# Altium project rX-rP.X4.PrjPcb
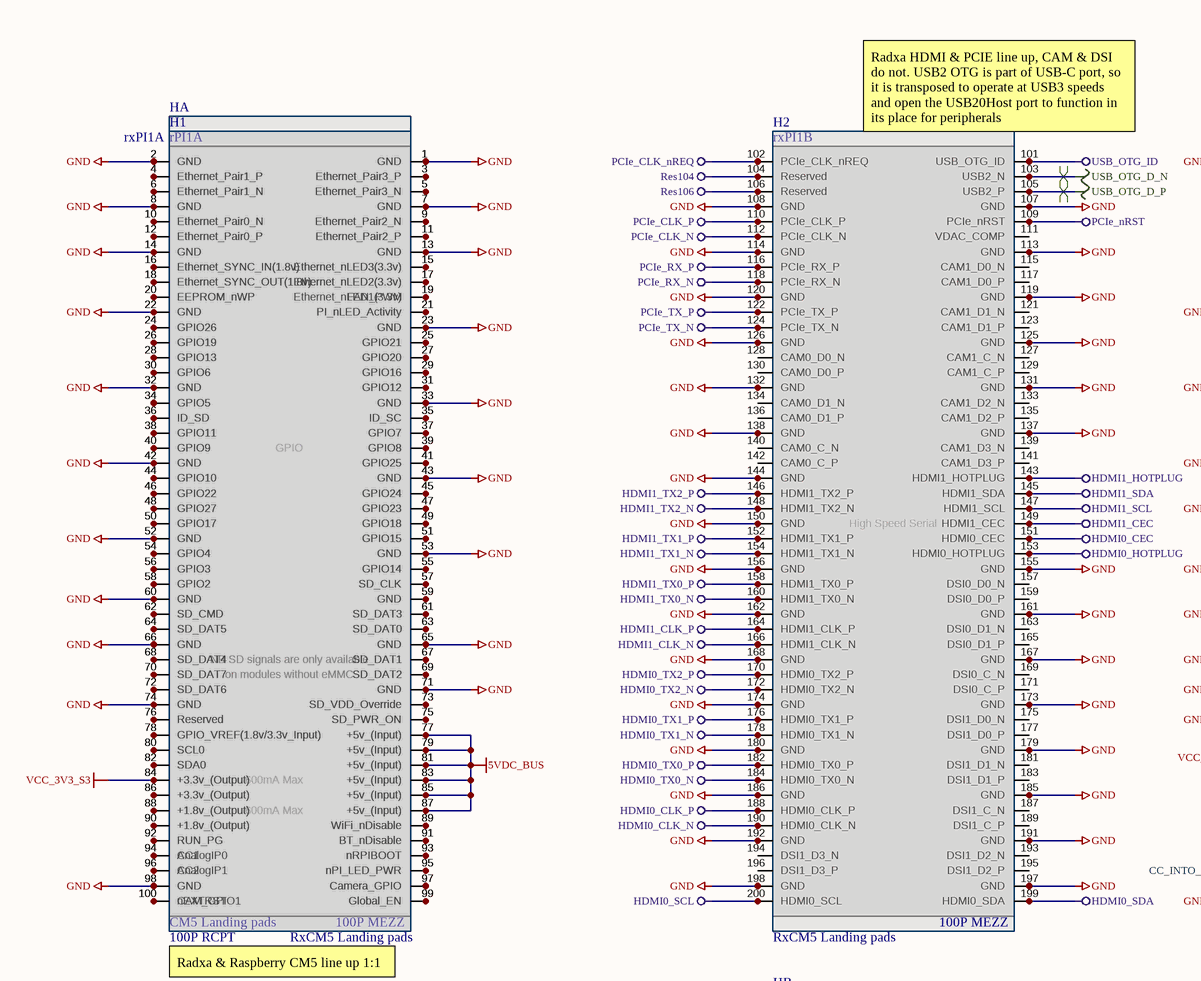
[diagram p0: CM5 Adapter.SchDoc, top left]
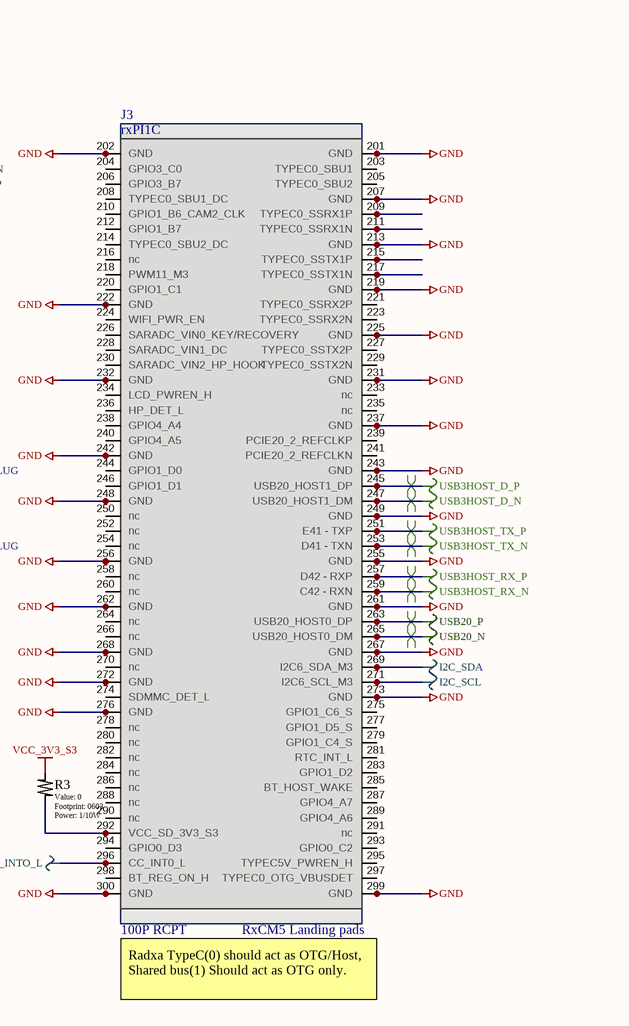
[diagram p1: CM5 Adapter.SchDoc, top right]
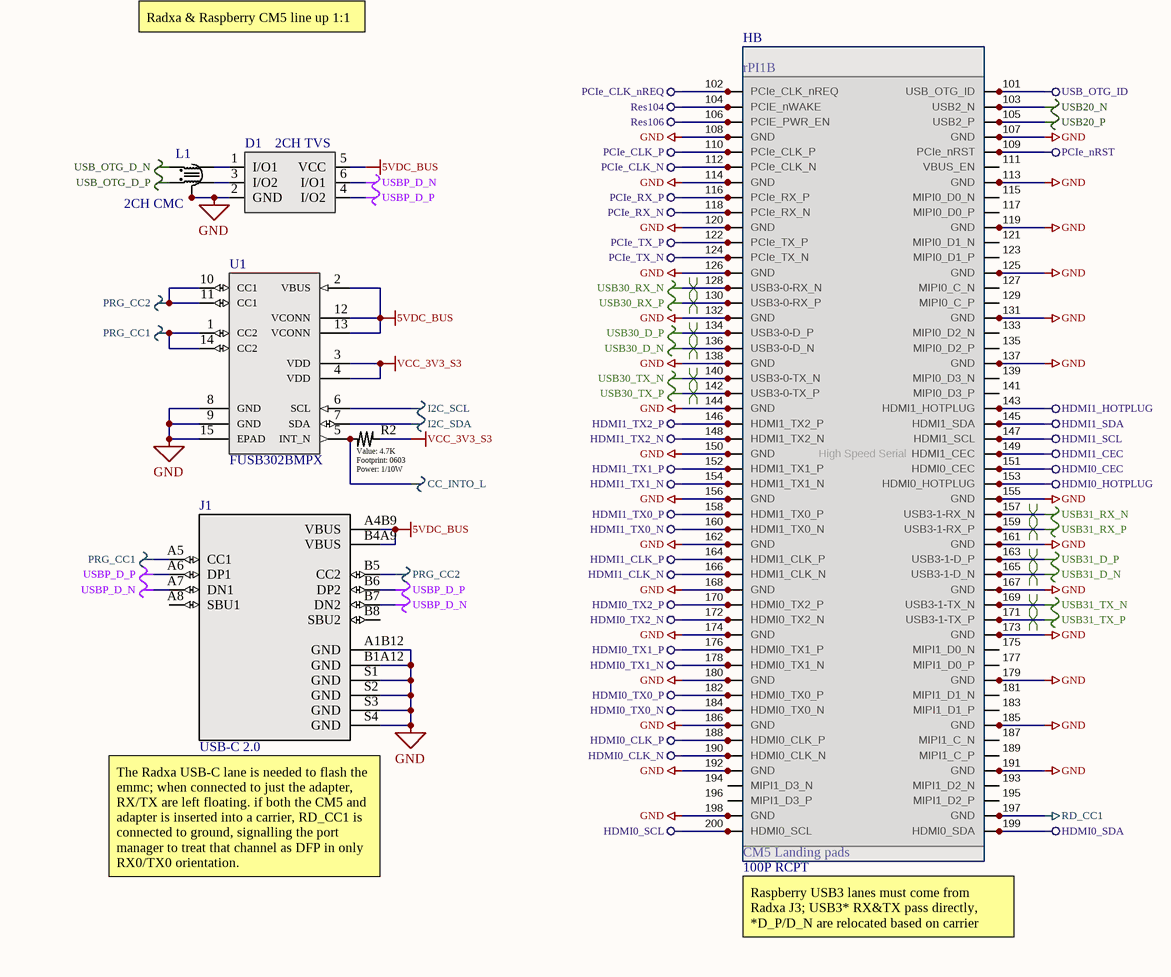
[diagram p2: CM5 Adapter.SchDoc, bottom left]
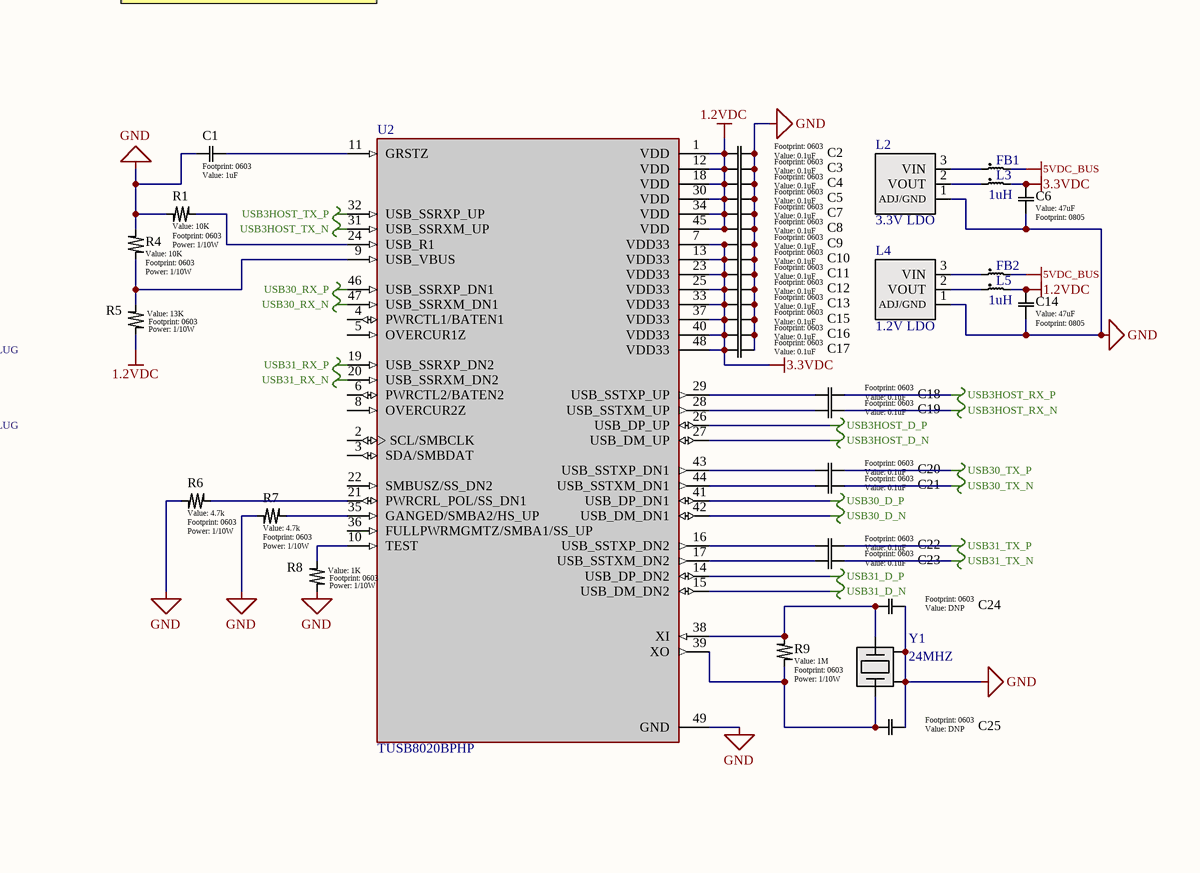
[diagram p3: CM5 Adapter.SchDoc, bottom right]
1 sheet, 53 parts. Net scope: global (net labels, ports and power ports of the same name join across sheets).
Board file: CM5_Adapter.PcbDoc

## Sheet CM5 Adapter.SchDoc
size C; SheetNumber: 1; SheetTotal: 1

### Parts
C1  value 1uF  [0603]  (hidden comment: Generic Capacitor)
C2  value 0.1uF  [0603]  (hidden comment: Generic Capacitor)
C3  value 0.1uF  [0603]  (hidden comment: Generic Capacitor)
C4  value 0.1uF  [0603]  (hidden comment: Generic Capacitor)
C5  value 0.1uF  [0603]  (hidden comment: Generic Capacitor)
C6  value 47uF  [0805]  (hidden comment: Generic Capacitor)
C7  value 0.1uF  [0603]  (hidden comment: Generic Capacitor)
C8  value 0.1uF  [0603]  (hidden comment: Generic Capacitor)
C9  value 0.1uF  [0603]  (hidden comment: Generic Capacitor)
C10  value 0.1uF  [0603]  (hidden comment: Generic Capacitor)
C11  value 0.1uF  [0603]  (hidden comment: Generic Capacitor)
C12  value 0.1uF  [0603]  (hidden comment: Generic Capacitor)
C13  value 0.1uF  [0603]  (hidden comment: Generic Capacitor)
C14  value 47uF  [0805]  (hidden comment: Generic Capacitor)
C15  value 0.1uF  [0603]  (hidden comment: Generic Capacitor)
C16  value 0.1uF  [0603]  (hidden comment: Generic Capacitor)
C17  value 0.1uF  [0603]  (hidden comment: Generic Capacitor)
C18  value 0.1uF  [0603]  (hidden comment: Generic Capacitor)
C19  value 0.1uF  [0603]  (hidden comment: Generic Capacitor)
C20  value 0.1uF  [0603]  (hidden comment: Generic Capacitor)
C21  value 0.1uF  [0603]  (hidden comment: Generic Capacitor)
C22  value 0.1uF  [0603]  (hidden comment: Generic Capacitor)
C23  value 0.1uF  [0603]  (hidden comment: Generic Capacitor)
C24  value DNP  [0603]  (hidden comment: Generic Capacitor)
C25  value DNP  [0603]  (hidden comment: Generic Capacitor)
D1  2CH TVS  [FP-SOT886-MFG]
FB1  BLM21PG221SN1D  [0805]  (value not drawn)
FB2  BLM21PG221SN1D  [0805]  (value not drawn)
H1  100P RCPT  [DF40C-100DS-0.4V(51)]
H2  100P MEZZ  [DF40C-100DS-0.4V(51)]
HA  100P MEZZ  [DF40C-100DP-0.4V(51)]
HB  100P RCPT  [DF40C-100DP-0.4V(51)]
J1  USB-C 2.0  [GT-USB-7010ASV]
J3  100P RCPT  [DF40C-100DS-0.4V(51)]
L1  2CH CMC  [SMD-6-2CH]
L2  3.3V LDO  [SOT-223-3]
L3  1uH  [0806]
L4  1.2V LDO  [SOT-223-3]
L5  1uH  [0806]
R1  value 10K  Power: 1/10W  [0603]  (hidden comment: Generic Resistor)
R2  value 4.7K  Power: 1/10W  [0603]  (hidden comment: Generic Resistor)
R3  value 0  Power: 1/10W  [0603]  (hidden comment: Generic Resistor)
R4  value 10K  Power: 1/10W  [0603]  (hidden comment: Generic Resistor)
R5  value 13K  Power: 1/10W  [0603]  (hidden comment: Generic Resistor)
R6  value 4.7k  Power: 1/10W  [0603]  (hidden comment: Generic Resistor)
R7  value 4.7k  Power: 1/10W  [0603]  (hidden comment: Generic Resistor)
R8  value 1K  Power: 1/10W  [0603]  (hidden comment: Generic Resistor)
R9  value 1M  Power: 1/10W  [0603]  (hidden comment: Generic Resistor)
rPI1  CM5 Landing pads  [rP-200P-CM-REP (top)]  (parts A,B of 2)
rxPI1  RxCM5 Landing pads  [RX-300P-CM-FTPD]  (parts A,B,C of 3)
U1  FUSB302BMPX  [MLP14_2P5X2P5_ONS-L]
U2  TUSB8020BPHP  [HTQFP-48(7x7)]
Y1  24MHZ  [SMD2520-4P]

### Nets
1.2VDC: C2.2 C3.2 C4.2 C5.2 C7.2 C8.2 C14.1 L5.2 R5.1 U2.1(VDD) U2.12(VDD) U2.18(VDD) U2.30(VDD) U2.34(VDD) U2.45(VDD)
3.3VDC: C6.1 C9.2 C10.2 C11.2 C12.2 C13.2 C15.2 C16.2 C17.2 L3.2 U2.7(VDD33) U2.13(VDD33) U2.23(VDD33) U2.25(VDD33) U2.33(VDD33) U2.37(VDD33) U2.40(VDD33) U2.48(VDD33)
5VDC_BUS: D1.5(VCC) FB1.2 FB2.2 H1.77 H1.79 H1.81 H1.83 H1.85 H1.87 HA.78 HA.80 HA.82 HA.84 HA.86 HA.88 J1.A4B9(VBUS) J1.B4A9(VBUS) rPI1.77(+5v_(Input)) rPI1.79(+5v_(Input)) rPI1.81(+5v_(Input)) rPI1.83(+5v_(Input)) rPI1.85(+5v_(Input)) rPI1.87(+5v_(Input)) rxPI1.77(+5v_(Input)) rxPI1.79(+5v_(Input)) rxPI1.81(+5v_(Input)) rxPI1.83(+5v_(Input)) rxPI1.85(+5v_(Input)) rxPI1.87(+5v_(Input)) U1.2(VBUS) U1.12(VCONN) U1.13(VCONN)
CC_INTO_L: J3.95 R2.1 rxPI1.296(CC_INT0_L) U1.5(INT_N)
GND: C1.1 C2.1 C3.1 C4.1 C5.1 C6.2 C7.1 C8.1 C9.1 C10.1 C11.1 C12.1 C13.1 C14.2 C15.1 C16.1 C17.1 C24.1 C25.1 D1.2(GND) H1.1 H1.2 H1.7 H1.8 H1.13 H1.14 H1.22 H1.23 H1.32 H1.33 H1.42 H1.43 H1.52 H1.53 H1.60 H1.65 H1.66 H1.71 H1.74 H1.98 H2.7 H2.8 H2.13 H2.14 H2.19 H2.20 H2.25 H2.26 H2.31 H2.32 H2.37 H2.38 H2.44 H2.50 H2.55 H2.56 H2.61 H2.62 H2.67 H2.68 H2.73 H2.74 H2.79 H2.80 H2.85 H2.86 H2.91 H2.92 H2.97 H2.98 HA.1 HA.2 HA.7 HA.8 HA.13 HA.14 HA.21 HA.24 HA.31 HA.34 HA.41 HA.44 HA.51 HA.54 HA.59 HA.65 HA.66 HA.72 HA.73 HA.97 HB.7 HB.8 HB.13 HB.14 HB.19 HB.20 HB.25 HB.26 HB.31 HB.32 HB.37 HB.38 HB.43 HB.49 HB.55 HB.56 HB.61 HB.62 HB.67 HB.68 HB.73 HB.74 HB.79 HB.80 HB.85 HB.86 HB.91 HB.92 HB.97 J1.A1B12(GND) J1.B1A12(GND) J1.S1(GND) J1.S2(GND) J1.S3(GND) J1.S4(GND) J3.1 J3.2 J3.8 J3.14 J3.20 J3.21 J3.26 J3.31 J3.32 J3.38 J3.41 J3.44 J3.47 J3.50 J3.55 J3.56 J3.61 J3.62 J3.67 J3.68 J3.71 J3.74 J3.75 J3.99 J3.100 L1.5 L1.6 L2.1(ADJ/GND) L4.1(ADJ/GND) R1.1 R4.1 R6.1 R7.1 R8.1 rPI1.1(GND) rPI1.2(GND) rPI1.7(GND) rPI1.8(GND) rPI1.13(GND) rPI1.14(GND) rPI1.22(GND) rPI1.23(GND) rPI1.32(GND) rPI1.33(GND) rPI1.42(GND) rPI1.43(GND) rPI1.52(GND) rPI1.53(GND) rPI1.60(GND) rPI1.65(GND) rPI1.66(GND) rPI1.71(GND) rPI1.74(GND) rPI1.98(GND) rPI1.107(GND) rPI1.108(GND) rPI1.113(GND) rPI1.114(GND) rPI1.119(GND) rPI1.120(GND) rPI1.125(GND) rPI1.126(GND) rPI1.131(GND) rPI1.132(GND) rPI1.137(GND) rPI1.138(GND) rPI1.144(GND) rPI1.150(GND) rPI1.155(GND) rPI1.156(GND) rPI1.161(GND) rPI1.162(GND) rPI1.167(GND) rPI1.168(GND) rPI1.173(GND) rPI1.174(GND) rPI1.179(GND) rPI1.180(GND) rPI1.185(GND) rPI1.186(GND) rPI1.191(GND) rPI1.192(GND) rPI1.198(GND) rxPI1.1(GND) rxPI1.2(GND) rxPI1.7(GND) rxPI1.8(GND) rxPI1.13(GND) rxPI1.14(GND) rxPI1.22(GND) rxPI1.23(GND) rxPI1.32(GND) rxPI1.33(GND) rxPI1.42(GND) rxPI1.43(GND) rxPI1.52(GND) rxPI1.53(GND) rxPI1.60(GND) rxPI1.65(GND) rxPI1.66(GND) rxPI1.71(GND) rxPI1.74(GND) rxPI1.98(GND) rxPI1.107(GND) rxPI1.108(GND) rxPI1.113(GND) rxPI1.114(GND) rxPI1.119(GND) rxPI1.120(GND) rxPI1.125(GND) rxPI1.126(GND) rxPI1.131(GND) rxPI1.132(GND) rxPI1.137(GND) rxPI1.138(GND) rxPI1.144(GND) rxPI1.150(GND) rxPI1.155(GND) rxPI1.156(GND) rxPI1.161(GND) rxPI1.162(GND) rxPI1.167(GND) rxPI1.168(GND) rxPI1.173(GND) rxPI1.174(GND) rxPI1.179(GND) rxPI1.180(GND) rxPI1.185(GND) rxPI1.186(GND) rxPI1.191(GND) rxPI1.192(GND) rxPI1.197(GND) rxPI1.198(GND) rxPI1.201(GND) rxPI1.202(GND) rxPI1.207(GND) rxPI1.213(GND) rxPI1.219(GND) rxPI1.222(GND) rxPI1.225(GND) rxPI1.231(GND) rxPI1.232(GND) rxPI1.237(GND) rxPI1.242(GND) rxPI1.243(GND) rxPI1.248(GND) rxPI1.249(GND) rxPI1.255(GND) rxPI1.256(GND) rxPI1.261(GND) rxPI1.262(GND) rxPI1.267(GND) rxPI1.268(GND) rxPI1.272(GND) rxPI1.273(GND) rxPI1.276(GND) rxPI1.299(GND) rxPI1.300(GND) U1.8(GND) U1.9(GND) U1.15(EPAD) U2.49(GND) Y1.2(GND) Y1.4(GND)
HDMI0_CEC: H2.51 HB.52 rPI1.151(HDMI0_CEC) rxPI1.151(HDMI0_CEC)
HDMI0_CLK_N: H2.90 HB.89 rPI1.190(HDMI0_CLK_N) rxPI1.190(HDMI0_CLK_N)
HDMI0_CLK_P: H2.88 HB.87 rPI1.188(HDMI0_CLK_P) rxPI1.188(HDMI0_CLK_P)
HDMI0_HOTPLUG: H2.53 HB.54 rPI1.153(HDMI0_HOTPLUG) rxPI1.153(HDMI0_HOTPLUG)
HDMI0_SCL: H2.100 HB.99 rPI1.200(HDMI0_SCL) rxPI1.200(HDMI0_SCL)
HDMI0_SDA: H2.99 HB.100 rPI1.199(HDMI0_SDA) rxPI1.199(HDMI0_SDA)
HDMI0_TX0_N: H2.84 HB.83 rPI1.184(HDMI0_TX0_N) rxPI1.184(HDMI0_TX0_N)
HDMI0_TX0_P: H2.82 HB.81 rPI1.182(HDMI0_TX0_P) rxPI1.182(HDMI0_TX0_P)
HDMI0_TX1_N: H2.78 HB.77 rPI1.178(HDMI0_TX1_N) rxPI1.178(HDMI0_TX1_N)
HDMI0_TX1_P: H2.76 HB.75 rPI1.176(HDMI0_TX1_P) rxPI1.176(HDMI0_TX1_P)
HDMI0_TX2_N: H2.72 HB.71 rPI1.172(HDMI0_TX2_N) rxPI1.172(HDMI0_TX2_N)
HDMI0_TX2_P: H2.70 HB.69 rPI1.170(HDMI0_TX2_P) rxPI1.170(HDMI0_TX2_P)
HDMI1_CEC: H2.49 HB.50 rPI1.149(HDMI1_CEC) rxPI1.149(HDMI1_CEC)
HDMI1_CLK_N: H2.66 HB.65 rPI1.166(HDMI1_CLK_N) rxPI1.166(HDMI1_CLK_N)
HDMI1_CLK_P: H2.64 HB.63 rPI1.164(HDMI1_CLK_P) rxPI1.164(HDMI1_CLK_P)
HDMI1_HOTPLUG: H2.43 HB.44 rPI1.143(HDMI1_HOTPLUG) rxPI1.143(HDMI1_HOTPLUG)
HDMI1_SCL: H2.47 HB.48 rPI1.147(HDMI1_SCL) rxPI1.147(HDMI1_SCL)
HDMI1_SDA: H2.45 HB.46 rPI1.145(HDMI1_SDA) rxPI1.145(HDMI1_SDA)
HDMI1_TX0_N: H2.60 HB.59 rPI1.160(HDMI1_TX0_N) rxPI1.160(HDMI1_TX0_N)
HDMI1_TX0_P: H2.58 HB.57 rPI1.158(HDMI1_TX0_P) rxPI1.158(HDMI1_TX0_P)
HDMI1_TX1_N: H2.54 HB.53 rPI1.154(HDMI1_TX1_N) rxPI1.154(HDMI1_TX1_N)
HDMI1_TX1_P: H2.52 HB.51 rPI1.152(HDMI1_TX1_P) rxPI1.152(HDMI1_TX1_P)
HDMI1_TX2_N: H2.48 HB.47 rPI1.148(HDMI1_TX2_N) rxPI1.148(HDMI1_TX2_N)
HDMI1_TX2_P: H2.46 HB.45 rPI1.146(HDMI1_TX2_P) rxPI1.146(HDMI1_TX2_P)
I2C_SCL: J3.72 rxPI1.271(I2C6_SCL_M3) U1.6(SCL)
I2C_SDA: J3.70 rxPI1.269(I2C6_SDA_M3) U1.7(SDA)
PCIe_CLK_N: H2.12 HB.11 rPI1.112(PCIe_CLK_N) rxPI1.112(PCIe_CLK_N)
PCIe_CLK_nREQ: H2.2 HB.1 rPI1.102(PCIe_CLK_nREQ) rxPI1.102(PCIe_CLK_nREQ)
PCIe_CLK_P: H2.10 HB.9 rPI1.110(PCIe_CLK_P) rxPI1.110(PCIe_CLK_P)
PCIe_nRST: H2.9 HB.10 rPI1.109(PCIe_nRST) rxPI1.109(PCIe_nRST)
PCIe_RX_N: H2.18 HB.17 rPI1.118(PCIe_RX_N) rxPI1.118(PCIe_RX_N)
PCIe_RX_P: H2.16 HB.15 rPI1.116(PCIe_RX_P) rxPI1.116(PCIe_RX_P)
PCIe_TX_N: H2.24 HB.23 rPI1.124(PCIe_TX_N) rxPI1.124(PCIe_TX_N)
PCIe_TX_P: H2.22 HB.21 rPI1.122(PCIe_TX_P) rxPI1.122(PCIe_TX_P)
PRG_CC1: J1.A5(CC1) U1.1(CC2) U1.14(CC2)
PRG_CC2: J1.B5(CC2) U1.10(CC1) U1.11(CC1)
RD_CC1: HB.98 rPI1.197(GND)
Res104: H2.4 HB.3 rPI1.104(PCIE_nWAKE) rxPI1.104(Reserved)
Res106: H2.6 HB.5 rPI1.106(PCIE_PWR_EN) rxPI1.106(Reserved)
USB3HOST_D_N: J3.48 rxPI1.247(USB20_HOST1_DM) U2.27(USB_DM_UP)
USB3HOST_D_P: J3.46 rxPI1.245(USB20_HOST1_DP) U2.26(USB_DP_UP)
USB3HOST_RX_N: C19.1 J3.60 rxPI1.259(C42_-_RXN)
USB3HOST_RX_P: C18.1 J3.58 rxPI1.257(D42_-_RXP)
USB3HOST_TX_N: J3.54 rxPI1.253(D41_-_TXN) U2.31(USB_SSRXM_UP)
USB3HOST_TX_P: J3.52 rxPI1.251(E41_-_TXP) U2.32(USB_SSRXP_UP)
USB20_N: HB.4 J3.66 rPI1.103(USB2_N) rxPI1.265(USB20_HOST0_DM)
USB20_P: HB.6 J3.64 rPI1.105(USB2_P) rxPI1.263(USB20_HOST0_DP)
USB30_D_N: HB.35 rPI1.136(USB3-0-D_N) U2.42(USB_DM_DN1)
USB30_D_P: HB.33 rPI1.134(USB3-0-D_P) U2.41(USB_DP_DN1)
USB30_RX_N: HB.27 rPI1.128(USB3-0-RX_N) U2.47(USB_SSRXM_DN1)
USB30_RX_P: HB.29 rPI1.130(USB3-0-RX_P) U2.46(USB_SSRXP_DN1)
USB30_TX_N: C21.1 HB.39 rPI1.140(USB3-0-TX_N)
USB30_TX_P: C20.1 HB.41 rPI1.142(USB3-0-TX_P)
USB31_D_N: HB.66 rPI1.165(USB3-1-D_N) U2.15(USB_DM_DN2)
USB31_D_P: HB.64 rPI1.163(USB3-1-D_P) U2.14(USB_DP_DN2)
USB31_RX_N: HB.58 rPI1.157(USB3-1-RX_N) U2.20(USB_SSRXM_DN2)
USB31_RX_P: HB.60 rPI1.159(USB3-1-RX_P) U2.19(USB_SSRXP_DN2)
USB31_TX_N: C23.1 HB.70 rPI1.169(USB3-1-TX_N)
USB31_TX_P: C22.1 HB.72 rPI1.171(USB3-1-TX_P)
USB_OTG_D_N: H2.3 L1.1 rxPI1.103(USB2_N)
USB_OTG_D_P: H2.5 L1.2 rxPI1.105(USB2_P)
USB_OTG_ID: H2.1 HB.2 rPI1.101(USB_OTG_ID) rxPI1.101(USB_OTG_ID)
USBP_D_N: D1.6(I/O1) J1.A7(DN1) J1.B7(DN2)
USBP_D_P: D1.4(I/O2) J1.A6(DP1) J1.B6(DP2)
VCC_3V3_S3: H1.84 HA.83 R2.2 R3.1 rPI1.84(+3.3v_(Output)) rxPI1.84(+3.3v_(Output)) U1.3(VDD) U1.4(VDD)
NetC1_2: C1.2 U2.11(GRSTZ)
NetC18_2: C18.2 U2.29(USB_SSTXP_UP)
NetC19_2: C19.2 U2.28(USB_SSTXM_UP)
NetC20_2: C20.2 U2.43(USB_SSTXP_DN1)
NetC21_2: C21.2 U2.44(USB_SSTXM_DN1)
NetC22_2: C22.2 U2.16(USB_SSTXP_DN2)
NetC23_2: C23.2 U2.17(USB_SSTXM_DN2)
NetC24_2: C24.2 R9.1 U2.38(XI) Y1.3
NetC25_2: C25.2 R9.2 U2.39(XO) Y1.1
NetD1_1: D1.1(I/O1) L1.4
NetD1_3: D1.3(I/O2) L1.3
NetFB1_1: FB1.1 L2.3(VIN)
NetFB2_1: FB2.1 L4.3(VIN)
NetH1_3: H1.3 HA.4 rPI1.3(Ethernet_Pair3_P) rxPI1.3(Ethernet_Pair3_P)
NetH1_4: H1.4 HA.3 rPI1.4(Ethernet_Pair1_P) rxPI1.4(Ethernet_Pair1_P)
NetH1_5: H1.5 HA.6 rPI1.5(Ethernet_Pair3_N) rxPI1.5(Ethernet_Pair3_N)
NetH1_6: H1.6 HA.5 rPI1.6(Ethernet_Pair1_N) rxPI1.6(Ethernet_Pair1_N)
NetH1_9: H1.9 HA.10 rPI1.9(Ethernet_Pair2_N) rxPI1.9(Ethernet_Pair2_N)
NetH1_10: H1.10 HA.9 rPI1.10(Ethernet_Pair0_N) rxPI1.10(Ethernet_Pair0_N)
NetH1_11: H1.11 HA.12 rPI1.11(Ethernet_Pair2_P) rxPI1.11(Ethernet_Pair2_P)
NetH1_12: H1.12 HA.11 rPI1.12(Ethernet_Pair0_P) rxPI1.12(Ethernet_Pair0_P)
NetH1_15: H1.15 HA.16 rPI1.15(Ethernet_nLED3(3.3v)) rxPI1.15(Ethernet_nLED3(3.3v))
NetH1_16: H1.16 HA.15 rPI1.16(Ethernet_SYNC_IN(1.8v)) rxPI1.16(Ethernet_SYNC_IN(1.8v))
NetH1_17: H1.17 HA.18 rPI1.17(Ethernet_nLED2(3.3v)) rxPI1.17(Ethernet_nLED2(3.3v))
NetH1_18: H1.18 HA.17 rPI1.18(Ethernet_SYNC_OUT(1.8v)) rxPI1.18(Ethernet_SYNC_OUT(1.8v))
NetH1_19: H1.19 HA.20 rPI1.19(FAN_PWM) rxPI1.19(Ethernet_nLED1(3.3v))
NetH1_20: H1.20 HA.19 rPI1.20(EEPROM_nWP) rxPI1.20(EEPROM_nWP)
NetH1_21: H1.21 HA.22 rPI1.21(PI_nLED_Activity) rxPI1.21(PI_nLED_Activity)
NetH1_24: H1.24 HA.23 rPI1.24(GPIO26) rxPI1.24(GPIO26)
NetH1_25: H1.25 HA.26 rPI1.25(GPIO21) rxPI1.25(GPIO21)
NetH1_26: H1.26 HA.25 rPI1.26(GPIO19) rxPI1.26(GPIO19)
NetH1_27: H1.27 HA.28 rPI1.27(GPIO20) rxPI1.27(GPIO20)
NetH1_28: H1.28 HA.27 rPI1.28(GPIO13) rxPI1.28(GPIO13)
NetH1_29: H1.29 HA.30 rPI1.29(GPIO16) rxPI1.29(GPIO16)
NetH1_30: H1.30 HA.29 rPI1.30(GPIO6) rxPI1.30(GPIO6)
NetH1_31: H1.31 HA.32 rPI1.31(GPIO12) rxPI1.31(GPIO12)
NetH1_34: H1.34 HA.33 rPI1.34(GPIO5) rxPI1.34(GPIO5)
NetH1_35: H1.35 HA.36 rPI1.35(ID_SC) rxPI1.35(ID_SC)
NetH1_36: H1.36 HA.35 rPI1.36(ID_SD) rxPI1.36(ID_SD)
NetH1_37: H1.37 HA.38 rPI1.37(GPIO7) rxPI1.37(GPIO7)
NetH1_38: H1.38 HA.37 rPI1.38(GPIO11) rxPI1.38(GPIO11)
NetH1_39: H1.39 HA.40 rPI1.39(GPIO8) rxPI1.39(GPIO8)
NetH1_40: H1.40 HA.39 rPI1.40(GPIO9) rxPI1.40(GPIO9)
NetH1_41: H1.41 HA.42 rPI1.41(GPIO25) rxPI1.41(GPIO25)
NetH1_44: H1.44 HA.43 rPI1.44(GPIO10) rxPI1.44(GPIO10)
NetH1_45: H1.45 HA.46 rPI1.45(GPIO24) rxPI1.45(GPIO24)
NetH1_46: H1.46 HA.45 rPI1.46(GPIO22) rxPI1.46(GPIO22)
NetH1_47: H1.47 HA.48 rPI1.47(GPIO23) rxPI1.47(GPIO23)
NetH1_48: H1.48 HA.47 rPI1.48(GPIO27) rxPI1.48(GPIO27)
NetH1_49: H1.49 HA.50 rPI1.49(GPIO18) rxPI1.49(GPIO18)
NetH1_50: H1.50 HA.49 rPI1.50(GPIO17) rxPI1.50(GPIO17)
NetH1_51: H1.51 HA.52 rPI1.51(GPIO15) rxPI1.51(GPIO15)
NetH1_54: H1.54 HA.53 rPI1.54(GPIO4) rxPI1.54(GPIO4)
NetH1_55: H1.55 HA.56 rPI1.55(GPIO14) rxPI1.55(GPIO14)
NetH1_56: H1.56 HA.55 rPI1.56(GPIO3) rxPI1.56(GPIO3)
NetH1_57: H1.57 HA.58 rPI1.57(SD_CLK) rxPI1.57(SD_CLK)
NetH1_58: H1.58 HA.57 rPI1.58(GPIO2) rxPI1.58(GPIO2)
NetH1_59: H1.59 HA.60 rPI1.59(GND) rxPI1.59(GND)
NetH1_61: H1.61 HA.62 rPI1.61(SD_DAT3) rxPI1.61(SD_DAT3)
NetH1_62: H1.62 HA.61 rPI1.62(SD_CMD) rxPI1.62(SD_CMD)
NetH1_63: H1.63 HA.64 rPI1.63(SD_DAT0) rxPI1.63(SD_DAT0)
NetH1_64: H1.64 HA.63 rPI1.64(SD_DAT5) rxPI1.64(SD_DAT5)
NetH1_67: H1.67 HA.68 rPI1.67(SD_DAT1) rxPI1.67(SD_DAT1)
NetH1_68: H1.68 HA.67 rPI1.68(SD_DAT4) rxPI1.68(SD_DAT4)
NetH1_69: H1.69 HA.70 rPI1.69(SD_DAT2) rxPI1.69(SD_DAT2)
NetH1_70: H1.70 HA.69 rPI1.70(SD_DAT7) rxPI1.70(SD_DAT7)
NetH1_72: H1.72 HA.71 rPI1.72(SD_DAT6) rxPI1.72(SD_DAT6)
NetH1_73: H1.73 HA.74 rPI1.73(SD_VDD_Override) rxPI1.73(SD_VDD_Override)
NetH1_75: H1.75 HA.76 rPI1.75(SD_PWR_ON) rxPI1.75(SD_PWR_ON)
NetH1_76: H1.76 HA.75 rPI1.76(Reserved) rxPI1.76(Reserved)
NetH1_78: H1.78 HA.77 rPI1.78(GPIO_VREF(1.8v/3.3v_Input)) rxPI1.78(GPIO_VREF(1.8v/3.3v_Input))
NetH1_80: H1.80 HA.79 rPI1.80(SCL0) rxPI1.80(SCL0)
NetH1_82: H1.82 HA.81 rPI1.82(SDA0) rxPI1.82(SDA0)
NetH1_86: H1.86 HA.85 rPI1.86(+3.3v_(Output)) rxPI1.86(+3.3v_(Output))
NetH1_88: H1.88 HA.87 rPI1.88(+1.8v_(Output)) rxPI1.88(+1.8v_(Output))
NetH1_89: H1.89 HA.90 rPI1.89(WiFi_nDisable) rxPI1.89(WiFi_nDisable)
NetH1_90: H1.90 HA.89 rPI1.90(+1.8v_(Output)) rxPI1.90(+1.8v_(Output))
NetH1_91: H1.91 HA.92 rPI1.91(BT_nDisable) rxPI1.91(BT_nDisable)
NetH1_92: H1.92 HA.91 rPI1.92(RUN_PG) rxPI1.92(RUN_PG)
NetH1_93: H1.93 HA.94 rPI1.93(nRPIBOOT) rxPI1.93(nRPIBOOT)
NetH1_94: H1.94 HA.93 rPI1.94(CC1) rxPI1.94(AnalogIP0)
NetH1_95: H1.95 HA.96 rPI1.95(nPI_LED_PWR) rxPI1.95(nPI_LED_PWR)
NetH1_96: H1.96 HA.95 rPI1.96(CC2) rxPI1.96(AnalogIP1)
NetH1_97: H1.97 HA.98 rPI1.97(Camera_GPIO) rxPI1.97(Camera_GPIO)
NetH1_99: H1.99 HA.100 rPI1.99(Global_EN) rxPI1.99(Global_EN)
NetH1_100: H1.100 HA.99 rPI1.100(CAM_GPIO1) rxPI1.100(nEXTRST)
NetH2_11: H2.11 rxPI1.111(VDAC_COMP)
NetH2_15: H2.15 rxPI1.115(CAM1_D0_N)
NetH2_17: H2.17 rxPI1.117(CAM1_D0_P)
NetH2_21: H2.21 rxPI1.121(CAM1_D1_N)
NetH2_23: H2.23 rxPI1.123(CAM1_D1_P)
NetH2_27: H2.27 rxPI1.127(CAM1_C_N)
NetH2_28: H2.28 rxPI1.128(CAM0_D0_N)
NetH2_29: H2.29 rxPI1.129(CAM1_C_P)
NetH2_30: H2.30 rxPI1.130(CAM0_D0_P)
NetH2_33: H2.33 rxPI1.133(CAM1_D2_N)
NetH2_34: H2.34 rxPI1.134(CAM0_D1_N)
NetH2_35: H2.35 rxPI1.135(CAM1_D2_P)
NetH2_36: H2.36 rxPI1.136(CAM0_D1_P)
NetH2_39: H2.39 rxPI1.139(CAM1_D3_N)
NetH2_40: H2.40 rxPI1.140(CAM0_C_N)
NetH2_41: H2.41 rxPI1.141(CAM1_D3_P)
NetH2_42: H2.42 rxPI1.142(CAM0_C_P)
NetH2_57: H2.57 rxPI1.157(DSI0_D0_N)
NetH2_59: H2.59 rxPI1.159(DSI0_D0_P)
NetH2_63: H2.63 rxPI1.163(DSI0_D1_N)
NetH2_65: H2.65 rxPI1.165(DSI0_D1_P)
NetH2_69: H2.69 rxPI1.169(DSI0_C_N)
NetH2_71: H2.71 rxPI1.171(DSI0_C_P)
NetH2_75: H2.75 rxPI1.175(DSI1_D0_N)
NetH2_77: H2.77 rxPI1.177(DSI1_D0_P)
NetH2_81: H2.81 rxPI1.181(DSI1_D1_N)
NetH2_83: H2.83 rxPI1.183(DSI1_D1_P)
NetH2_87: H2.87 rxPI1.187(DSI1_C_N)
NetH2_89: H2.89 rxPI1.189(DSI1_C_P)
NetH2_93: H2.93 rxPI1.193(DSI1_D2_N)
NetH2_94: H2.94 rxPI1.194(DSI1_D3_N)
NetH2_95: H2.95 rxPI1.195(DSI1_D2_P)
NetH2_96: H2.96 rxPI1.196(DSI1_D3_P)
NetHB_12: HB.12 rPI1.111(VBUS_EN)
NetHB_16: HB.16 rPI1.115(MIPI0_D0_N)
NetHB_18: HB.18 rPI1.117(MIPI0_D0_P)
NetHB_22: HB.22 rPI1.121(MIPI0_D1_N)
NetHB_24: HB.24 rPI1.123(MIPI0_D1_P)
NetHB_28: HB.28 rPI1.127(MIPI0_C_N)
NetHB_30: HB.30 rPI1.129(MIPI0_C_P)
NetHB_34: HB.34 rPI1.133(MIPI0_D2_N)
NetHB_36: HB.36 rPI1.135(MIPI0_D2_P)
NetHB_40: HB.40 rPI1.139(MIPI0_D3_N)
NetHB_42: HB.42 rPI1.141(MIPI0_D3_P)
NetHB_76: HB.76 rPI1.175(MIPI1_D0_N)
NetHB_78: HB.78 rPI1.177(MIPI1_D0_P)
NetHB_82: HB.82 rPI1.181(MIPI1_D1_N)
NetHB_84: HB.84 rPI1.183(MIPI1_D1_P)
NetHB_88: HB.88 rPI1.187(MIPI1_C_N)
NetHB_90: HB.90 rPI1.189(MIPI1_C_P)
NetHB_93: HB.93 rPI1.194(MIPI1_D3_N)
NetHB_94: HB.94 rPI1.193(MIPI1_D2_N)
NetHB_95: HB.95 rPI1.196(MIPI1_D3_P)
NetHB_96: HB.96 rPI1.195(MIPI1_D2_P)
NetJ3_3: J3.3 rxPI1.204(GPIO3_C0)
NetJ3_4: J3.4 rxPI1.203(TYPEC0_SBU1)
NetJ3_5: J3.5 rxPI1.206(GPIO3_B7)
NetJ3_6: J3.6 rxPI1.205(TYPEC0_SBU2)
NetJ3_7: J3.7 rxPI1.208(TYPEC0_SBU1_DC)
NetJ3_9: J3.9 rxPI1.210(GPIO1_B6_CAM2_CLK)
NetJ3_10: J3.10 rxPI1.209(TYPEC0_SSRX1P)
NetJ3_11: J3.11 rxPI1.212(GPIO1_B7)
NetJ3_12: J3.12 rxPI1.211(TYPEC0_SSRX1N)
NetJ3_13: J3.13 rxPI1.214(TYPEC0_SBU2_DC)
NetJ3_15: J3.15 rxPI1.216(nc)
NetJ3_16: J3.16 rxPI1.215(TYPEC0_SSTX1P)
NetJ3_17: J3.17 rxPI1.218(PWM11_M3)
NetJ3_18: J3.18 rxPI1.217(TYPEC0_SSTX1N)
NetJ3_19: J3.19 rxPI1.220(GPIO1_C1)
NetJ3_22: J3.22 rxPI1.221(TYPEC0_SSRX2P)
NetJ3_23: J3.23 rxPI1.224(WIFI_PWR_EN)
NetJ3_24: J3.24 rxPI1.223(TYPEC0_SSRX2N)
NetJ3_25: J3.25 rxPI1.226(SARADC_VIN0_KEY/RECOVERY)
NetJ3_27: J3.27 rxPI1.228(SARADC_VIN1_DC)
NetJ3_28: J3.28 rxPI1.227(TYPEC0_SSTX2P)
NetJ3_29: J3.29 rxPI1.230(SARADC_VIN2_HP_HOOK)
NetJ3_30: J3.30 rxPI1.229(TYPEC0_SSTX2N)
NetJ3_33: J3.33 rxPI1.234(LCD_PWREN_H)
NetJ3_34: J3.34 rxPI1.233(nc)
NetJ3_35: J3.35 rxPI1.236(HP_DET_L)
NetJ3_36: J3.36 rxPI1.235(nc)
NetJ3_37: J3.37 rxPI1.238(GPIO4_A4)
NetJ3_39: J3.39 rxPI1.240(GPIO4_A5)
NetJ3_40: J3.40 rxPI1.239(PCIE20_2_REFCLKP)
NetJ3_42: J3.42 rxPI1.241(PCIE20_2_REFCLKN)
NetJ3_43: J3.43 rxPI1.244(GPIO1_D0)
NetJ3_45: J3.45 rxPI1.246(GPIO1_D1)
NetJ3_49: J3.49 rxPI1.250(nc)
NetJ3_51: J3.51 rxPI1.252(nc)
NetJ3_53: J3.53 rxPI1.254(nc)
NetJ3_57: J3.57 rxPI1.258(nc)
NetJ3_59: J3.59 rxPI1.260(nc)
NetJ3_63: J3.63 rxPI1.264(nc)
NetJ3_65: J3.65 rxPI1.266(nc)
NetJ3_69: J3.69 rxPI1.270(nc)
NetJ3_73: J3.73 rxPI1.274(SDMMC_DET_L)
NetJ3_76: J3.76 rxPI1.275(GPIO1_C6_S)
NetJ3_77: J3.77 rxPI1.278(nc)
NetJ3_78: J3.78 rxPI1.277(GPIO1_D5_S)
NetJ3_79: J3.79 rxPI1.280(nc)
NetJ3_80: J3.80 rxPI1.279(GPIO1_C4_S)
NetJ3_81: J3.81 rxPI1.282(nc)
NetJ3_82: J3.82 rxPI1.281(RTC_INT_L)
NetJ3_83: J3.83 rxPI1.284(nc)
NetJ3_84: J3.84 rxPI1.283(GPIO1_D2)
NetJ3_85: J3.85 rxPI1.286(nc)
NetJ3_86: J3.86 rxPI1.285(BT_HOST_WAKE)
NetJ3_87: J3.87 rxPI1.288(nc)
NetJ3_88: J3.88 rxPI1.287(GPIO4_A7)
NetJ3_89: J3.89 rxPI1.290(nc)
NetJ3_90: J3.90 rxPI1.289(GPIO4_A6)
NetJ3_91: J3.91 R3.2 rxPI1.292(VCC_SD_3V3_S3)
NetJ3_92: J3.92 rxPI1.291(nc)
NetJ3_93: J3.93 rxPI1.294(GPIO0_D3)
NetJ3_94: J3.94 rxPI1.293(GPIO0_C2)
NetJ3_96: J3.96 rxPI1.295(TYPEC5V_PWREN_H)
NetJ3_97: J3.97 rxPI1.298(BT_REG_ON_H)
NetJ3_98: J3.98 rxPI1.297(TYPEC0_OTG_VBUSDET)
NetL2_2: L2.2(VOUT) L3.1
NetL4_2: L4.2(VOUT) L5.1
NetR1_2: R1.2 U2.24(USB_R1)
NetR4_2: R4.2 R5.2 U2.9(USB_VBUS)
NetR6_2: R6.2 U2.21(PWRCRL_POL/SS_DN1)
NetR7_2: R7.2 U2.35(GANGED/SMBA2/HS_UP)
NetR8_2: R8.2 U2.10(TEST)

Not connected (* = marked no-connect by the designer): J1 A8(SBU1) B8(SBU2); U2 2(SCL/SMBCLK) 3(SDA/SMBDAT) 4(PWRCTL1/BATEN1) 5(OVERCUR1Z) 6(PWRCTL2/BATEN2) 8(OVERCUR2Z) 22(SMBUSZ/SS_DN2) 36(FULLPWRMGMTZ/SMBA1/SS_UP)

### Layout directives
differential pair: USB3HOST_D_N, USB3HOST_D_P, USB3HOST_RX_N, USB3HOST_RX_P, USB3HOST_TX_N, USB3HOST_TX_P, USB20_N, USB20_P, USB30_D_N, USB30_D_P, USB30_RX_N, USB30_RX_P, USB30_TX_N, USB30_TX_P, USB31_D_N, USB31_D_P, USB31_RX_N, USB31_RX_P, USB31_TX_N, USB31_TX_P, USB_OTG_D_N, USB_OTG_D_P

### Notes on the sheet
- Radxa HDMI & PCIE line up, CAM & DSI do not. USB2 OTG is part of USB-C port, so it is transposed to operate at USB3 speeds and open the USB20Host port to function in its place for peripherals
- Radxa & Raspberry CM5 line up 1:1
- Radxa TypeC(0) should act as OTG/Host, Shared bus(1) Should act as OTG only.
- (near J1) The Radxa USB-C lane is needed to flash the emmc; when connected to just the adapter, RX/TX are left floating. if both the CM5 and adapter is inserted into a carrier, RD_CC1 is connected to ground, signalling the port manager to treat that channel as DFP in only RX0/TX0 orientation.
- Raspberry USB3 lanes must come from Radxa J3; USB3* RX&TX pass directly, *D_P/D_N are relocated based on carrier function
- REV
- REVISIONS
- DATE
- DESCRIPTION
- BY
- UNLESS OTHERWISE SPECIFIED, DRAWING DEFINITIONS AND TOLERANCES SHALL BE FOUND UNDER SUPPLIER STANDARDS SS-001. THIS PART AND ALL COMPONENTS OF IT MUST BE RoHS & REACH COMPLIANT. A CERTIFICATE OF COMPLIANCE MUST BE PROVIDED UPON REQUEST.
- ALL INFORMATION ON THIS DOCUMENT IS THE SOLE PROPERTY OF GAMBER-JOHNSON AND SHALL NOT BE COPIED, REPRODUCED, USED OR DISCLOSED IN WHOLE OR IN PART WITHOUT THE WRITTEN CONSENT OF GAMBER-JOHNSON
- TOLERANCES
  .00 ± .060
  .000 ± .020
  .0000 ± .005
  ANGELS ± 1°
- DRAWN BY:
- PROJECT NUMBER:
- SHEET TITLE:
- SHEET
- OF
- DATE:
- LOCATION:
- ASSEMBLY NUMBER
- SIZE
- GAMBER-JOHNSON LLC
  5001 JOERNS DR.
  STEVENS POINT, WI 54481
  +1 (715) 344-5209
- B
- (in symbol RP-CM5-Rep, part A) GPIO; NB SD signals are only available; on modules without eMMC; 600mA Max
- (in symbol RP-CM5-Rep, part B) High Speed Serial
- (in symbol RX-CM5, part A) GPIO; NB SD signals are only available; on modules without eMMC; 600mA Max
- (in symbol RX-CM5, part B) High Speed Serial

### Library data of the parts
C1 C6 C14 C24 C25 = Generic Capacitor: Voltage: >10V; Tolerance: 10%
C2-C5 C7-C13 C15-C23 = Generic Capacitor: Voltage: 10V; Tolerance: 10%
D1 = PRTR5V0U2F,115: TVS DIODE 5.5V 6XSON SOT886; Manufacturer: Nexperia; Capacitance: 1pF; Number Of Channels: 2; Automotive Grade: Grade 3; Direction: Unidirectional; Value: 1pF; Breakdown Voltage: 6V; Octopart: https://octopart.com/prtr5v0u2f%2C115-nexperia-78741690; Height: 0.5mm; Category: Diode; RoHS: TRUE; Automotive: Yes; Reverse Standoff Voltage: 5.5V; Digikey Description: TVS DIODE 5.5V 6XSON SOT886; Device Class L1: Circuit Protection; Ambient Temperature Range High: +85°C; ComponentLink2Description: Datasheet; Manufacturer Part Number: PRTR5V0U2F,115; Device Class L3: unset; Footprint Url: https://assets.nexperia.com/documents/outline-drawing/SOT886.pdf; Lead Free: Yes; Ambient Temperature Range Low: -40°C; Device Class L2: TVS Diodes; Package: SOT886; ComponentLink2URL: https://assets.nexperia.com/documents/data-sheet/PRTR5V0U2F_PRTR5V0U2K.pdf; LCSC PN: C478118; Supplier 1: Future Electronics; Supplier Part Number 1: 6047094
FB1 FB2 = BLM21PG221SN1D: 220 Ohms @ 100 MHz 1 Power Line Ferrite Bead 0805 (2012 Metric) 2A 45mOhm; Manufacturer: Murata; Material: Ferrite,Steel; Impedance: 220R; Tolerance: 25%; DC Resistance (DCR): 45mR; Number of Lines: 1; Test Frequency: 100MHz; Shielding: Unshielded; Supplier 1: Newark; Supplier Part Number 1: 73M9167; Manufacturer Part Number: BLM21PG221SN1D; RoHS: Yes; Category: Ferrite Beads and Chips; Stock 1: 21832; Pricing 1: 1=0.10000, 10=0.05300, 25=0.04700, 50=0.04200, 100=0.03600 (USD); Case/Package: 0805; Number of Pins: 2; Core Material: Ferrite; Case Code (Metric): 2012; Case Code (Imperial): 0805; Contact Plating: Tin,Matte; Min Operating Temperature: -55°C; Max Operating Temperature: 125°C; Max DC Current: 2A; Package Quantity: 1; Max Current Rating: 2A; Packaging: Tape and Reel; Current Rating: 2A; Termination: SMD/SMT; DC Current: 2A; Frequency: 100MHz; Number of Circuits: 1; Current: 2A; Series: BLM21P; DC Resistance-Max: 45mR; Length: 2mm; Width: 1.25mm; Height: 0.85mm; Depth: 1.25mm; Radiation Hardening: No; REACH SVHC: No SVHC; Military Standard: Not; Lead Free: Lead Free; RoHS Compliant: Yes; ComponentLink1URL: https://datasheet.ciiva.com/1012/l0110s0100blm21p-1012288.pdf?src-supplier=Digi-Key; ComponentLink1Description: https://datasheet.ciiva.com/1012/l0110s0100blm21p-1012288.pdf?src-supplier=Digi-Key; ComponentLink2URL: https://datasheet.ciiva.com/30514/1845321-30514028.pdf?src-supplier=Jameco; ComponentLink2Description: https://datasheet.ciiva.com/30514/1845321-30514028.pdf?src-supplier=Jameco; ComponentLink3URL: https://datasheet.ciiva.com/11799/0900766b81275e31-11799232.pdf?src-supplier=RSComponents; ComponentLink3Description: https://datasheet.ciiva.com/11799/0900766b81275e31-11799232.pdf?src-supplier=RSComponents; ComponentLink4URL: https://datasheet.ciiva.com/29348/442529-da-01-en-chip-drossel-0805-220r-2000ma-2-0x1-25mm-29348007.pdf?src-supplier=Conrad; ComponentLink4Description: https://datasheet.ciiva.com/29348/442529-da-01-en-chip-drossel-0805-220r-2000ma-2-0x1-25mm-29348007.pdf?src-supplier=Conrad; ComponentLink5URL: https://datasheet.ciiva.com/1012/l0110s0100blm21p-1012287.pdf?src-supplier=Digi-Key; ComponentLink5Description: https://datasheet.ciiva.com/1012/l0110s0100blm21p-1012287.pdf?src-supplier=Digi-Key; ComponentLink6URL: https://datasheet.ciiva.com/1012/l0110s0100blm21p-1012289.pdf?src-supplier=Digi-Key; ComponentLink6Description: https://datasheet.ciiva.com/1012/l0110s0100blm21p-1012289.pdf?src-supplier=Digi-Key; ComponentLink7URL: https://datasheet.ciiva.com/3081/l0110s0100blm21p-3081655.pdf?src-supplier=Avnet; ComponentLink7Description: https://datasheet.ciiva.com/3081/l0110s0100blm21p-3081655.pdf?src-supplier=Avnet; ComponentLink8URL: https://datasheet.ciiva.com/14122/anblm21p-data-e-14122214.pdf?src-supplier=Distrelec; ComponentLink8Description: https://datasheet.ciiva.com/14122/anblm21p-data-e-14122214.pdf?src-supplier=Distrelec; ComponentLink9URL: https://datasheet.ciiva.com/16215/l0110s0100blm21p-16215194.pdf?src-supplier=Future+Electronics; ComponentLink9Description: https://datasheet.ciiva.com/16215/l0110s0100blm21p-16215194.pdf?src-supplier=Future+Electronics; ComponentLink10URL: https://datasheet.ciiva.com/8021/1756152-8021596.pdf?src-supplier=Element14; ComponentLink10Description: https://datasheet.ciiva.com/8021/1756152-8021596.pdf?src-supplier=Element14; ComponentLink11URL: https://datasheet.ciiva.com/8021/1756152-8021598.pdf?src-supplier=Element14; ComponentLink11Description: https://datasheet.ciiva.com/8021/1756152-8021598.pdf?src-supplier=Element14
H1 H2 J3 = DF40-100DS RCPT_1: 100 Position Connector Receptacle, Center Strip Contacts Surface Mount Gold; MF: Hirose; SnapEDA_Link: https://www.snapeda.com/parts/DF40C-100DS-0.4V(51)/Hirose/view-part/?ref=snap; Package: None; Value: *; MP: DF40C-100DS-0.4V(51); Check_prices: https://www.snapeda.com/parts/DF40C-100DS-0.4V(51)/Hirose/view-part/?ref=eda; LCSC PN: C597931; Supplier 1: Avnet; Supplier Part Number 1: DF40C-100DS-0.4V(5; Supplier 2: Digikey; Supplier Part Number 2: 26-DF40HC(3.0)-100DS-0.4V(51)CT-ND
HA HB = DF40-XX-100DS RCPT: 100 Position Connector Receptacle, Center Strip Contacts Surface Mount Gold; MF: Hirose; MP: DF40C-100DS-0.4V(51); SnapEDA_Link: https://www.snapeda.com/parts/DF40C-100DS-0.4V(51)/Hirose/view-part/?ref=snap; Package: None; Value: *; Check_prices: https://www.snapeda.com/parts/DF40C-100DS-0.4V(51)/Hirose/view-part/?ref=eda; LCSC PN: C19089239; Supplier 1: Avnet; Supplier Part Number 1: DF40C-100DS-0.4V(5; Supplier 2: Digikey; Supplier Part Number 2: 26-DF40HC(3.0)-100DS-0.4V(51)CT-ND
J1 = 12402012E212A: USB-C (USB TYPE-C) USB 2.0 Receptacle Connector 24 (16+8 Dummy) Position Surface Mount, Right Angle; Through Hole; LCSC PN: C2988369; Supplier 1: Newark; Supplier Part Number 1: 71AJ9393; Supplier 2: Avnet; Supplier Part Number 2: 12402012E212A
L1 = ICMEF112P350MFR: 35Ω@100MHz -40℃~+85℃ 4Ω 5V 2 100mA SMD Common Mode Filters ROHS; LCSC PN: C396460; Supplier 1: Mouser; Supplier Part Number 1: 710-748020024
L2 = ZLDO1117QG33TA: 80dB@(120Hz) 1A Fixed 3.3V~3.3V Positive 18V SOT-223 Linear Voltage Regulator; LCSC PN: C326523
L3 L5 = HMLQ20161T-1R0MDR: 1µH Shielded Fixed Inductor 59mOhm Max 0806 (2016 Metric) -; Manufacturer 1: Cyntec; Supplier 1: Digi-Key; Manufacturer Part Number 1: HMLQ20161T-1R0MDR; RoHS: No; Stock 1: 1810; Pricing 1: 1=0.26000, 10=0.23200, 25=0.20320, 50=0.17400, 100=0.15950, 250=0.14500, 500=0.13630, 1000=0.10440 (USD); Supplier Part Number 1: 2037-HMLQ20161T-1R0MDRCT-ND
L4 = SSP1117-1.2V: 1A Fixed 1.2V Positive 20V SOT-223 Linear Voltage Regulator; LCSC PN: C277890
R1-R9 = Generic Resistor: Tolerance: 1%
rPI1 = RP-CM5-Rep: Compute Module 5 adapter Footprint / Overlap Hirose 100P connector over pads to place actual components
rxPI1 = RX-CM5: Radxa Compute Module 5 Footprint / Overlap Hirose 100P connector over pads to place actual components
U1 = FUSB302BMPX: IC USB TYPE C CTLR PROGR 14-MLP; Manufacturer_Name: onsemi; Copyright: Copyright (C) 2025 Ultra Librarian. All rights reserved.; Manufacturer_Part_Number: FUSB302BMPX; RefDes: RefDes; Type: Type; LCSC PN: C132291
U2 = TUSB8020BPHP: USB Hub Controller USB 3.0; LCSC PN: C205982; Supplier 1: Mouser; Supplier Part Number 1: 595-TUSB8020BPHP
Y1 = CM4024M00020001: 24MHz 20pF ±10ppm ±30ppm SMD-2520-4P Crystals ROHS; LCSC PN: C7294628